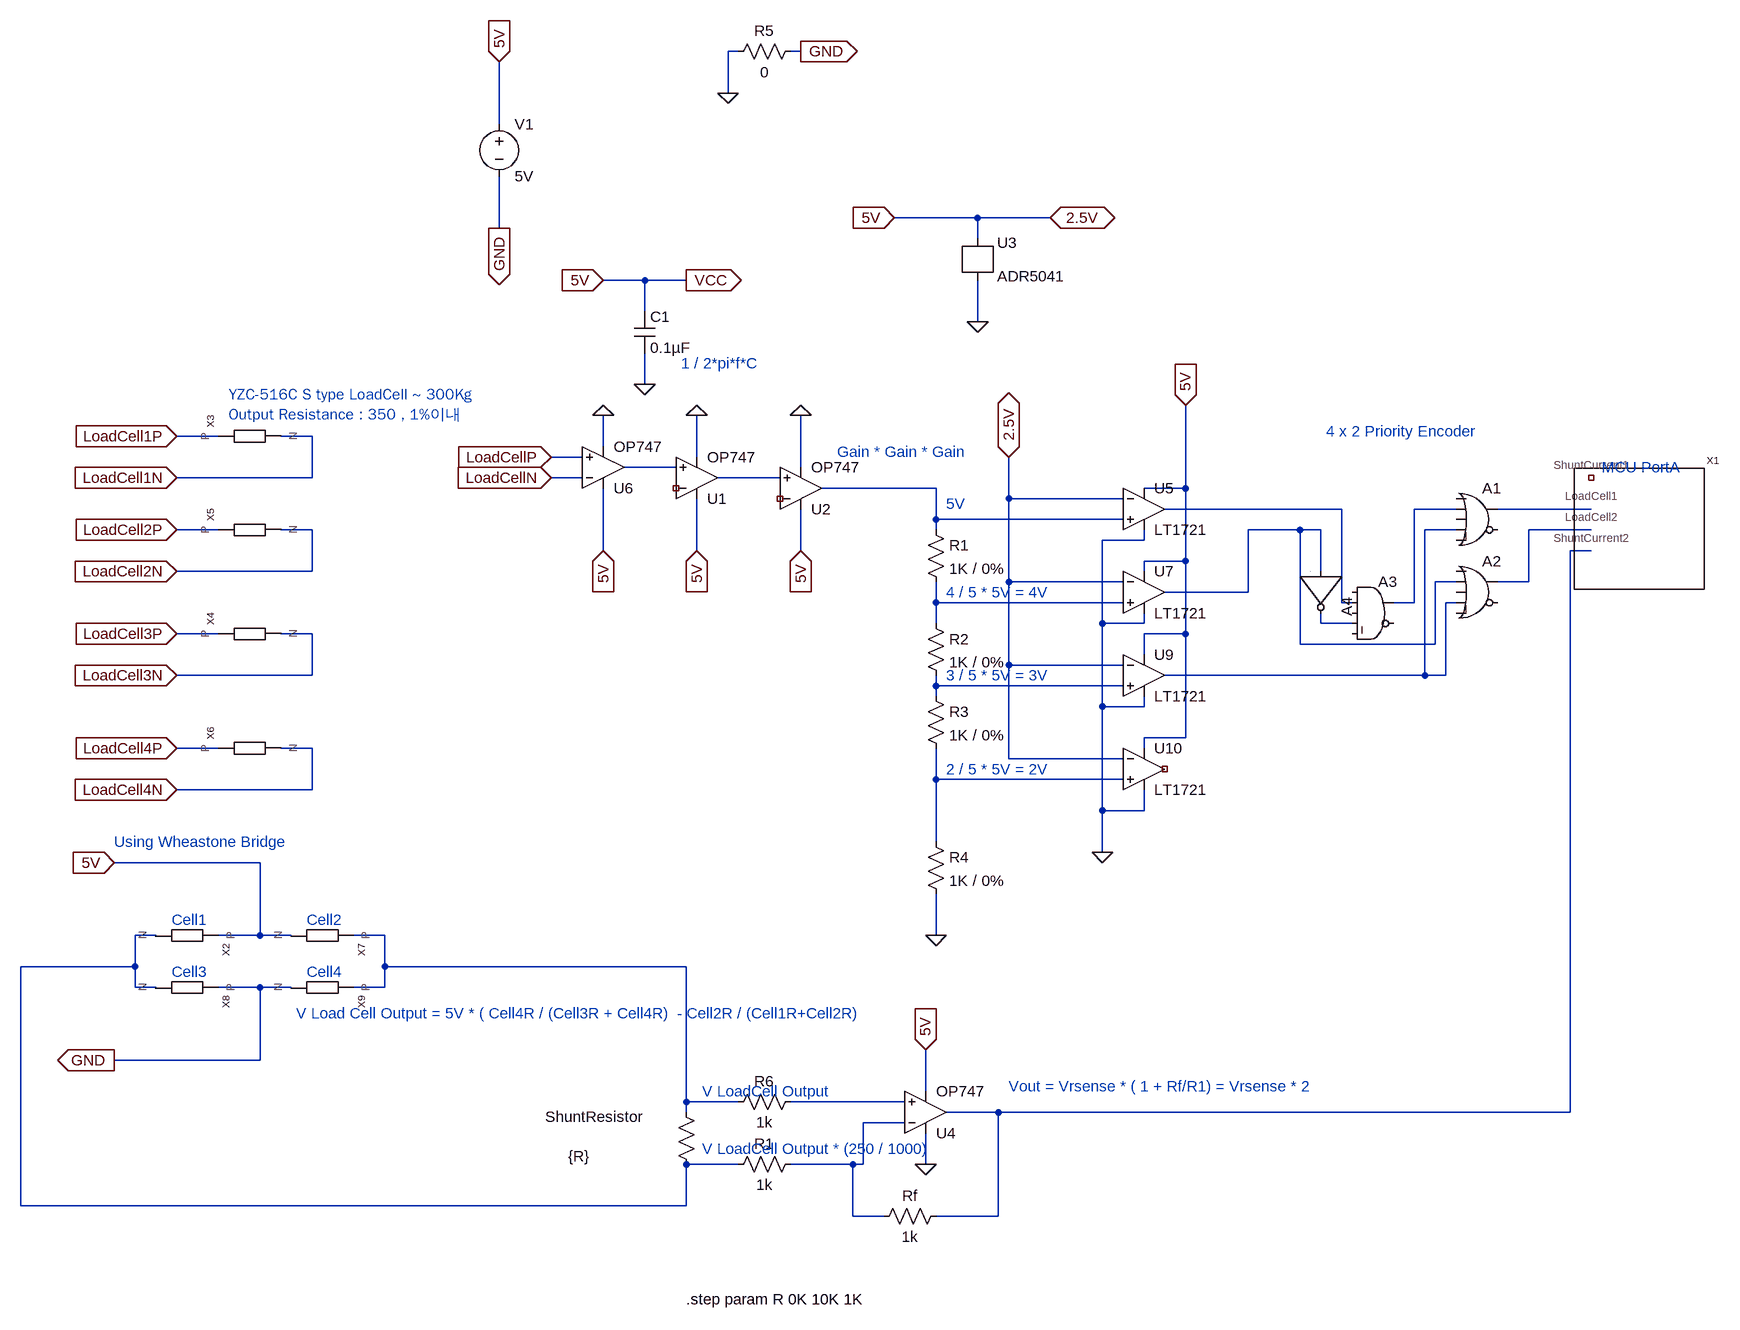
[diagram p0: schematic LoadCell Amplifier.asc]
LoadCell Amplifier.asc, the LTspice schematic file:
Version 4
SHEET 1 1936 2104
WIRE 416 0 400 0
WIRE 512 0 496 0
WIRE 400 64 400 0
WIRE 48 112 48 16
WIRE 784 256 656 256
WIRE 896 256 784 256
WIRE 48 272 48 192
WIRE 784 288 784 256
WIRE 272 352 208 352
WIRE 336 352 272 352
WIRE 272 400 272 352
WIRE 784 416 784 352
WIRE 272 512 272 464
WIRE -384 592 -448 592
WIRE -240 592 -288 592
WIRE 208 608 208 560
WIRE 176 624 128 624
WIRE 352 624 352 560
WIRE 320 640 240 640
WIRE 512 640 512 560
WIRE -240 656 -240 592
WIRE -240 656 -448 656
WIRE 176 656 128 656
WIRE 480 656 384 656
WIRE 720 672 544 672
WIRE 1104 672 1104 544
WIRE 1104 672 1040 672
WIRE 832 688 832 624
WIRE 1008 688 832 688
WIRE 1344 704 1072 704
WIRE 1520 704 1456 704
WIRE 1728 704 1584 704
WIRE 720 720 720 672
WIRE 1008 720 720 720
WIRE -384 736 -448 736
WIRE -240 736 -288 736
WIRE 720 736 720 720
WIRE 1280 736 1200 736
WIRE 1312 736 1280 736
WIRE 1520 736 1472 736
WIRE 1728 736 1632 736
WIRE 1040 752 1040 736
WIRE 1040 752 976 752
WIRE 208 768 208 672
WIRE 352 768 352 688
WIRE 512 768 512 704
WIRE 1728 768 1696 768
WIRE 1104 784 1104 672
WIRE 1104 784 1040 784
WIRE -240 800 -240 736
WIRE -240 800 -448 800
WIRE 1040 800 1040 784
WIRE 1312 800 1312 736
WIRE 832 816 832 688
WIRE 1008 816 832 816
WIRE 1520 816 1488 816
WIRE 1632 816 1632 736
WIRE 1632 816 1584 816
WIRE 1200 832 1200 736
WIRE 1200 832 1072 832
WIRE 720 848 720 816
WIRE 1008 848 720 848
WIRE 1344 848 1344 704
WIRE 1360 848 1344 848
WIRE 1456 848 1456 704
WIRE 1456 848 1424 848
WIRE 1520 848 1504 848
WIRE 720 880 720 848
WIRE 976 880 976 752
WIRE 1040 880 1040 864
WIRE 1040 880 976 880
WIRE 1312 880 1312 864
WIRE 1360 880 1312 880
WIRE -384 896 -448 896
WIRE -240 896 -288 896
WIRE 1104 896 1104 784
WIRE 1104 896 1040 896
WIRE 1280 912 1280 736
WIRE 1488 912 1488 816
WIRE 1488 912 1280 912
WIRE 1040 928 1040 896
WIRE 832 944 832 816
WIRE 1008 944 832 944
WIRE -240 960 -240 896
WIRE -240 960 -448 960
WIRE 1472 960 1472 736
WIRE 1472 960 1072 960
WIRE 1504 960 1504 848
WIRE 1504 960 1472 960
WIRE 720 976 720 960
WIRE 1008 976 720 976
WIRE 720 992 720 976
WIRE 976 1008 976 880
WIRE 1040 1008 1040 992
WIRE 1040 1008 976 1008
WIRE 1104 1056 1104 896
WIRE 1104 1056 1040 1056
WIRE -384 1072 -448 1072
WIRE -240 1072 -288 1072
WIRE 1040 1072 1040 1056
WIRE 832 1088 832 944
WIRE 1008 1088 832 1088
WIRE 720 1120 720 1072
WIRE 1008 1120 720 1120
WIRE -240 1136 -240 1072
WIRE -240 1136 -448 1136
WIRE 976 1168 976 1008
WIRE 1040 1168 1040 1136
WIRE 1040 1168 976 1168
WIRE 720 1216 720 1120
WIRE 976 1232 976 1168
WIRE -320 1248 -544 1248
WIRE -480 1360 -512 1360
WIRE -320 1360 -320 1248
WIRE -320 1360 -384 1360
WIRE -272 1360 -320 1360
WIRE -128 1360 -176 1360
WIRE 720 1360 720 1296
WIRE -512 1408 -512 1360
WIRE -512 1408 -688 1408
WIRE -128 1408 -128 1360
WIRE 336 1408 -128 1408
WIRE -512 1440 -512 1408
WIRE -480 1440 -512 1440
WIRE -320 1440 -384 1440
WIRE -272 1440 -320 1440
WIRE -128 1440 -128 1408
WIRE -128 1440 -176 1440
WIRE -320 1552 -320 1440
WIRE -320 1552 -544 1552
WIRE 704 1600 704 1536
WIRE 336 1616 336 1408
WIRE 416 1616 336 1616
WIRE 672 1616 496 1616
WIRE 336 1632 336 1616
WIRE 816 1632 736 1632
WIRE 1696 1632 1696 768
WIRE 1696 1632 816 1632
WIRE 672 1648 608 1648
WIRE 416 1712 336 1712
WIRE 592 1712 496 1712
WIRE 608 1712 608 1648
WIRE 608 1712 592 1712
WIRE 704 1712 704 1664
WIRE -688 1776 -688 1408
WIRE 336 1776 336 1712
WIRE 336 1776 -688 1776
WIRE 592 1792 592 1712
WIRE 640 1792 592 1792
WIRE 816 1792 816 1632
WIRE 816 1792 720 1792
FLAG 128 624 LoadCellP
IOPIN 128 624 In
FLAG 128 656 LoadCellN
IOPIN 128 656 In
FLAG 336 352 VCC
IOPIN 336 352 Out
FLAG 48 16 5V
IOPIN 48 16 In
FLAG 208 560 0
FLAG 208 768 5V
IOPIN 208 768 In
FLAG 720 1360 0
FLAG 208 352 5V
IOPIN 208 352 In
FLAG 272 512 0
FLAG 656 256 5V
IOPIN 656 256 In
FLAG 784 416 0
FLAG 896 256 2.5V
IOPIN 896 256 BiDir
FLAG 832 624 2.5V
IOPIN 832 624 BiDir
FLAG 1104 544 5V
IOPIN 1104 544 In
FLAG 976 1232 0
FLAG 48 272 GND
IOPIN 48 272 Out
FLAG 400 64 0
FLAG 512 0 GND
IOPIN 512 0 Out
FLAG 352 768 5V
IOPIN 352 768 In
FLAG 512 768 5V
IOPIN 512 768 In
FLAG 352 560 0
FLAG 512 560 0
FLAG 704 1536 5V
IOPIN 704 1536 In
FLAG 704 1712 0
FLAG -544 1248 5V
IOPIN -544 1248 In
FLAG -544 1552 GND
IOPIN -544 1552 Out
FLAG -448 736 LoadCell2P
IOPIN -448 736 In
FLAG -448 800 LoadCell2N
IOPIN -448 800 In
FLAG -448 896 LoadCell3P
IOPIN -448 896 In
FLAG -448 960 LoadCell3N
IOPIN -448 960 In
FLAG -448 1072 LoadCell4P
IOPIN -448 1072 In
FLAG -448 1136 LoadCell4N
IOPIN -448 1136 In
FLAG -448 592 LoadCell1P
IOPIN -448 592 In
FLAG -448 656 LoadCell1N
IOPIN -448 656 In
SYMBOL voltage 48 96 R0
SYMATTR InstName V1
SYMATTR Value 5V
SYMBOL OpAmps\\OP747 208 704 M180
SYMATTR InstName U6
SYMBOL OpAmps\\OP747 352 720 M180
SYMATTR InstName U1
SYMBOL OpAmps\\OP747 512 736 M180
SYMATTR InstName U2
SYMBOL res 704 720 R0
SYMATTR InstName R1
SYMATTR Value 1K / 0%
SYMBOL res 704 864 R0
SYMATTR InstName R2
SYMATTR Value 1K / 0%
SYMBOL res 704 976 R0
SYMATTR InstName R3
SYMATTR Value 1K / 0%
SYMBOL res 704 1200 R0
SYMATTR InstName R4
SYMATTR Value 1K / 0%
SYMBOL References\\ADR5041 784 320 R0
SYMATTR InstName U3
SYMBOL cap 256 400 R0
SYMATTR InstName C1
SYMATTR Value 0.1µF
SYMBOL Comparators\\LT1721 1040 640 R0
SYMATTR InstName U5
SYMBOL Comparators\\LT1721 1040 768 R0
SYMATTR InstName U7
SYMBOL Comparators\\LT1721 1040 896 R0
SYMATTR InstName U9
SYMBOL Comparators\\LT1721 1040 1040 R0
SYMATTR InstName U10
SYMBOL Digital\\or 1552 656 R0
SYMATTR InstName A1
SYMBOL Digital\\or 1552 768 R0
SYMATTR InstName A2
SYMBOL Digital\\and 1392 800 R0
SYMATTR InstName A3
SYMBOL Digital\\inv 1376 800 R90
SYMATTR InstName A4
SYMBOL MCU 1760 736 R0
SYMATTR InstName X1
SYMBOL res 512 -16 R90
WINDOW 0 0 56 VBottom 2
WINDOW 3 32 56 VTop 2
SYMATTR InstName R5
SYMATTR Value 0
SYMBOL OpAmps\\OP747 704 1696 M180
SYMATTR InstName U4
SYMBOL res 320 1616 R0
WINDOW 0 -201 23 Left 2
WINDOW 3 -166 84 Left 2
SYMATTR InstName ShuntResistor
SYMATTR Value {R}
SYMBOL res 512 1600 R90
WINDOW 0 0 56 VBottom 2
WINDOW 3 32 56 VTop 2
SYMATTR InstName R6
SYMATTR Value 1k
SYMBOL res 512 1696 R90
WINDOW 0 0 56 VBottom 2
WINDOW 3 32 56 VTop 2
SYMATTR InstName R1
SYMATTR Value 1k
SYMBOL res 736 1776 R90
WINDOW 0 0 56 VBottom 2
WINDOW 3 32 56 VTop 2
SYMATTR InstName Rf
SYMATTR Value 1k
SYMBOL LoadCell_R -320 576 R270
SYMATTR InstName X3
SYMBOL LoadCell_R -320 880 R270
SYMATTR InstName X4
SYMBOL LoadCell_R -320 720 R270
SYMATTR InstName X5
SYMBOL LoadCell_R -320 1056 R270
SYMATTR InstName X6
SYMBOL LoadCell_R -448 1376 R90
SYMATTR InstName X2
SYMBOL LoadCell_R -240 1376 R90
SYMATTR InstName X7
SYMBOL LoadCell_R -448 1456 R90
SYMATTR InstName X8
SYMBOL LoadCell_R -240 1456 R90
SYMATTR InstName X9
TEXT 328 480 Left 2 ;1 / 2*pi*f*C
TEXT 1744 640 Left 2 ;MCU PortA
TEXT 736 696 Left 2 ;5V
TEXT 736 832 Left 2 ;4 / 5 * 5V = 4V
TEXT 736 960 Left 2 ;3 / 5 * 5V = 3V
TEXT 736 1104 Left 2 ;2 / 5 * 5V = 2V
TEXT 1320 584 Left 2 ;4 x 2 Priority Encoder
TEXT 568 616 Left 2 ;Gain * Gain * Gain
TEXT -368 528 Left 2 ;YZC-516C S type LoadCell ~ 300Kg\nOutput Resistance : 350 , 1%이내
TEXT 832 1592 Left 2 ;Vout = Vrsense * ( 1 + Rf/R1) = Vrsense * 2
TEXT 360 1600 Left 2 ;V LoadCell Output
TEXT 360 1688 Left 2 ;V LoadCell Output * (250 / 1000)
TEXT 336 1920 Left 2 !.step param R 0K 10K 1K
TEXT -544 1216 Left 2 ;Using Wheastone Bridge
TEXT -456 1336 Left 2 ;Cell1
TEXT -456 1416 Left 2 ;Cell3
TEXT -248 1336 Left 2 ;Cell2
TEXT -248 1416 Left 2 ;Cell4
TEXT -264 1480 Left 2 ;V Load Cell Output = 5V * ( Cell4R / (Cell3R + Cell4R)  - Cell2R / (Cell1R+Cell2R)

The netlist it stands for:
* LoadCell Amplifier.asc
V1 2.5V GND 5V
XU6 LoadCellP LoadCellN 2.5V 0 N001 OP747  ; pins In+ In- V+ V- OUT
XU1 N001 NC_01 2.5V 0 N002 OP747  ; pins In+ In- V+ V- OUT
XU2 N002 NC_02 2.5V 0 N003 OP747  ; pins In+ In- V+ V- OUT
R1 N003 N011 1K / 0%
R2 N011 N013 1K / 0%
R3 N013 N014 1K / 0%
R4 N014 0 1K / 0%
XU3 2.5V 0 ADR5041
C1 2.5V 0 0.1µF
XU5 N003 2.5V 2.5V 0 N004 LT1720  ; LT1721, pins In+ In- V+ V- OUT
XU7 N011 2.5V 2.5V 0 N007 LT1720  ; LT1721, pins In+ In- V+ V- OUT
XU9 N013 2.5V 2.5V 0 N008 LT1720  ; LT1721, pins In+ In- V+ V- OUT
XU10 N014 2.5V 2.5V 0 NC_03 LT1720  ; LT1721, pins In+ In- V+ V- OUT
A1 0 N005 0 N008 0 0 N006 0 OR
A2 0 N007 0 N008 0 0 N009 0 OR
A3 0 N004 0 N012 0 0 N005 0 AND
A4 N007 0 0 0 0 N012 0 0 BUF
XX1 N006 N009 N010 NC_04 MCU  ; pins LoadCell1 LoadCell2 ShuntCurrent2 ShuntCurrent1
R5 GND 0 0
XU4 N017 N018 0 2.5V N010 OP747  ; pins In+ In- V+ V- OUT
R§ShuntResistor N016 N015 {R}
R6 N017 N016 1k
R1 N018 N015 1k
Rf N010 N018 1k
XX3 LoadCell1P LoadCell1N LoadCell_R  ; pins P N
XX4 LoadCell3P LoadCell3N LoadCell_R  ; pins P N
XX5 LoadCell2P LoadCell2N LoadCell_R  ; pins P N
XX6 LoadCell4P LoadCell4N LoadCell_R  ; pins P N
XX2 2.5V N015 LoadCell_R  ; pins P N
XX7 N016 2.5V LoadCell_R  ; pins P N
XX8 GND N015 LoadCell_R  ; pins P N
XX9 N016 GND LoadCell_R  ; pins P N
* 1 / 2*pi*f*C
* MCU PortA
* 5V
* 4 / 5 * 5V = 4V
* 3 / 5 * 5V = 3V
* 2 / 5 * 5V = 2V
* 4 x 2 Priority Encoder
* Gain * Gain * Gain
* YZC-516C S type LoadCell ~ 300Kg
* Output Resistance : 350 , 1%이내
* Vout = Vrsense * ( 1 + Rf/R1) = Vrsense * 2
* V LoadCell Output
* V LoadCell Output * (250 / 1000)
.step param R 0K 10K 1K
* Using Wheastone Bridge
* Cell1
* Cell3
* Cell2
* Cell4
* V Load Cell Output = 5V * ( Cell4R / (Cell3R + Cell4R)  - Cell2R / (Cell1R+Cell2R)
.lib ADR5041.sub
.lib LTC.lib
.backanno
.end